# EasyEDA schematic Wireless.json
TITLE: Sheet_1; REV: 1.0; Date: 2024-10-12; Sheet: 1/1; Drawn By: romansuk05; Company: Your Company
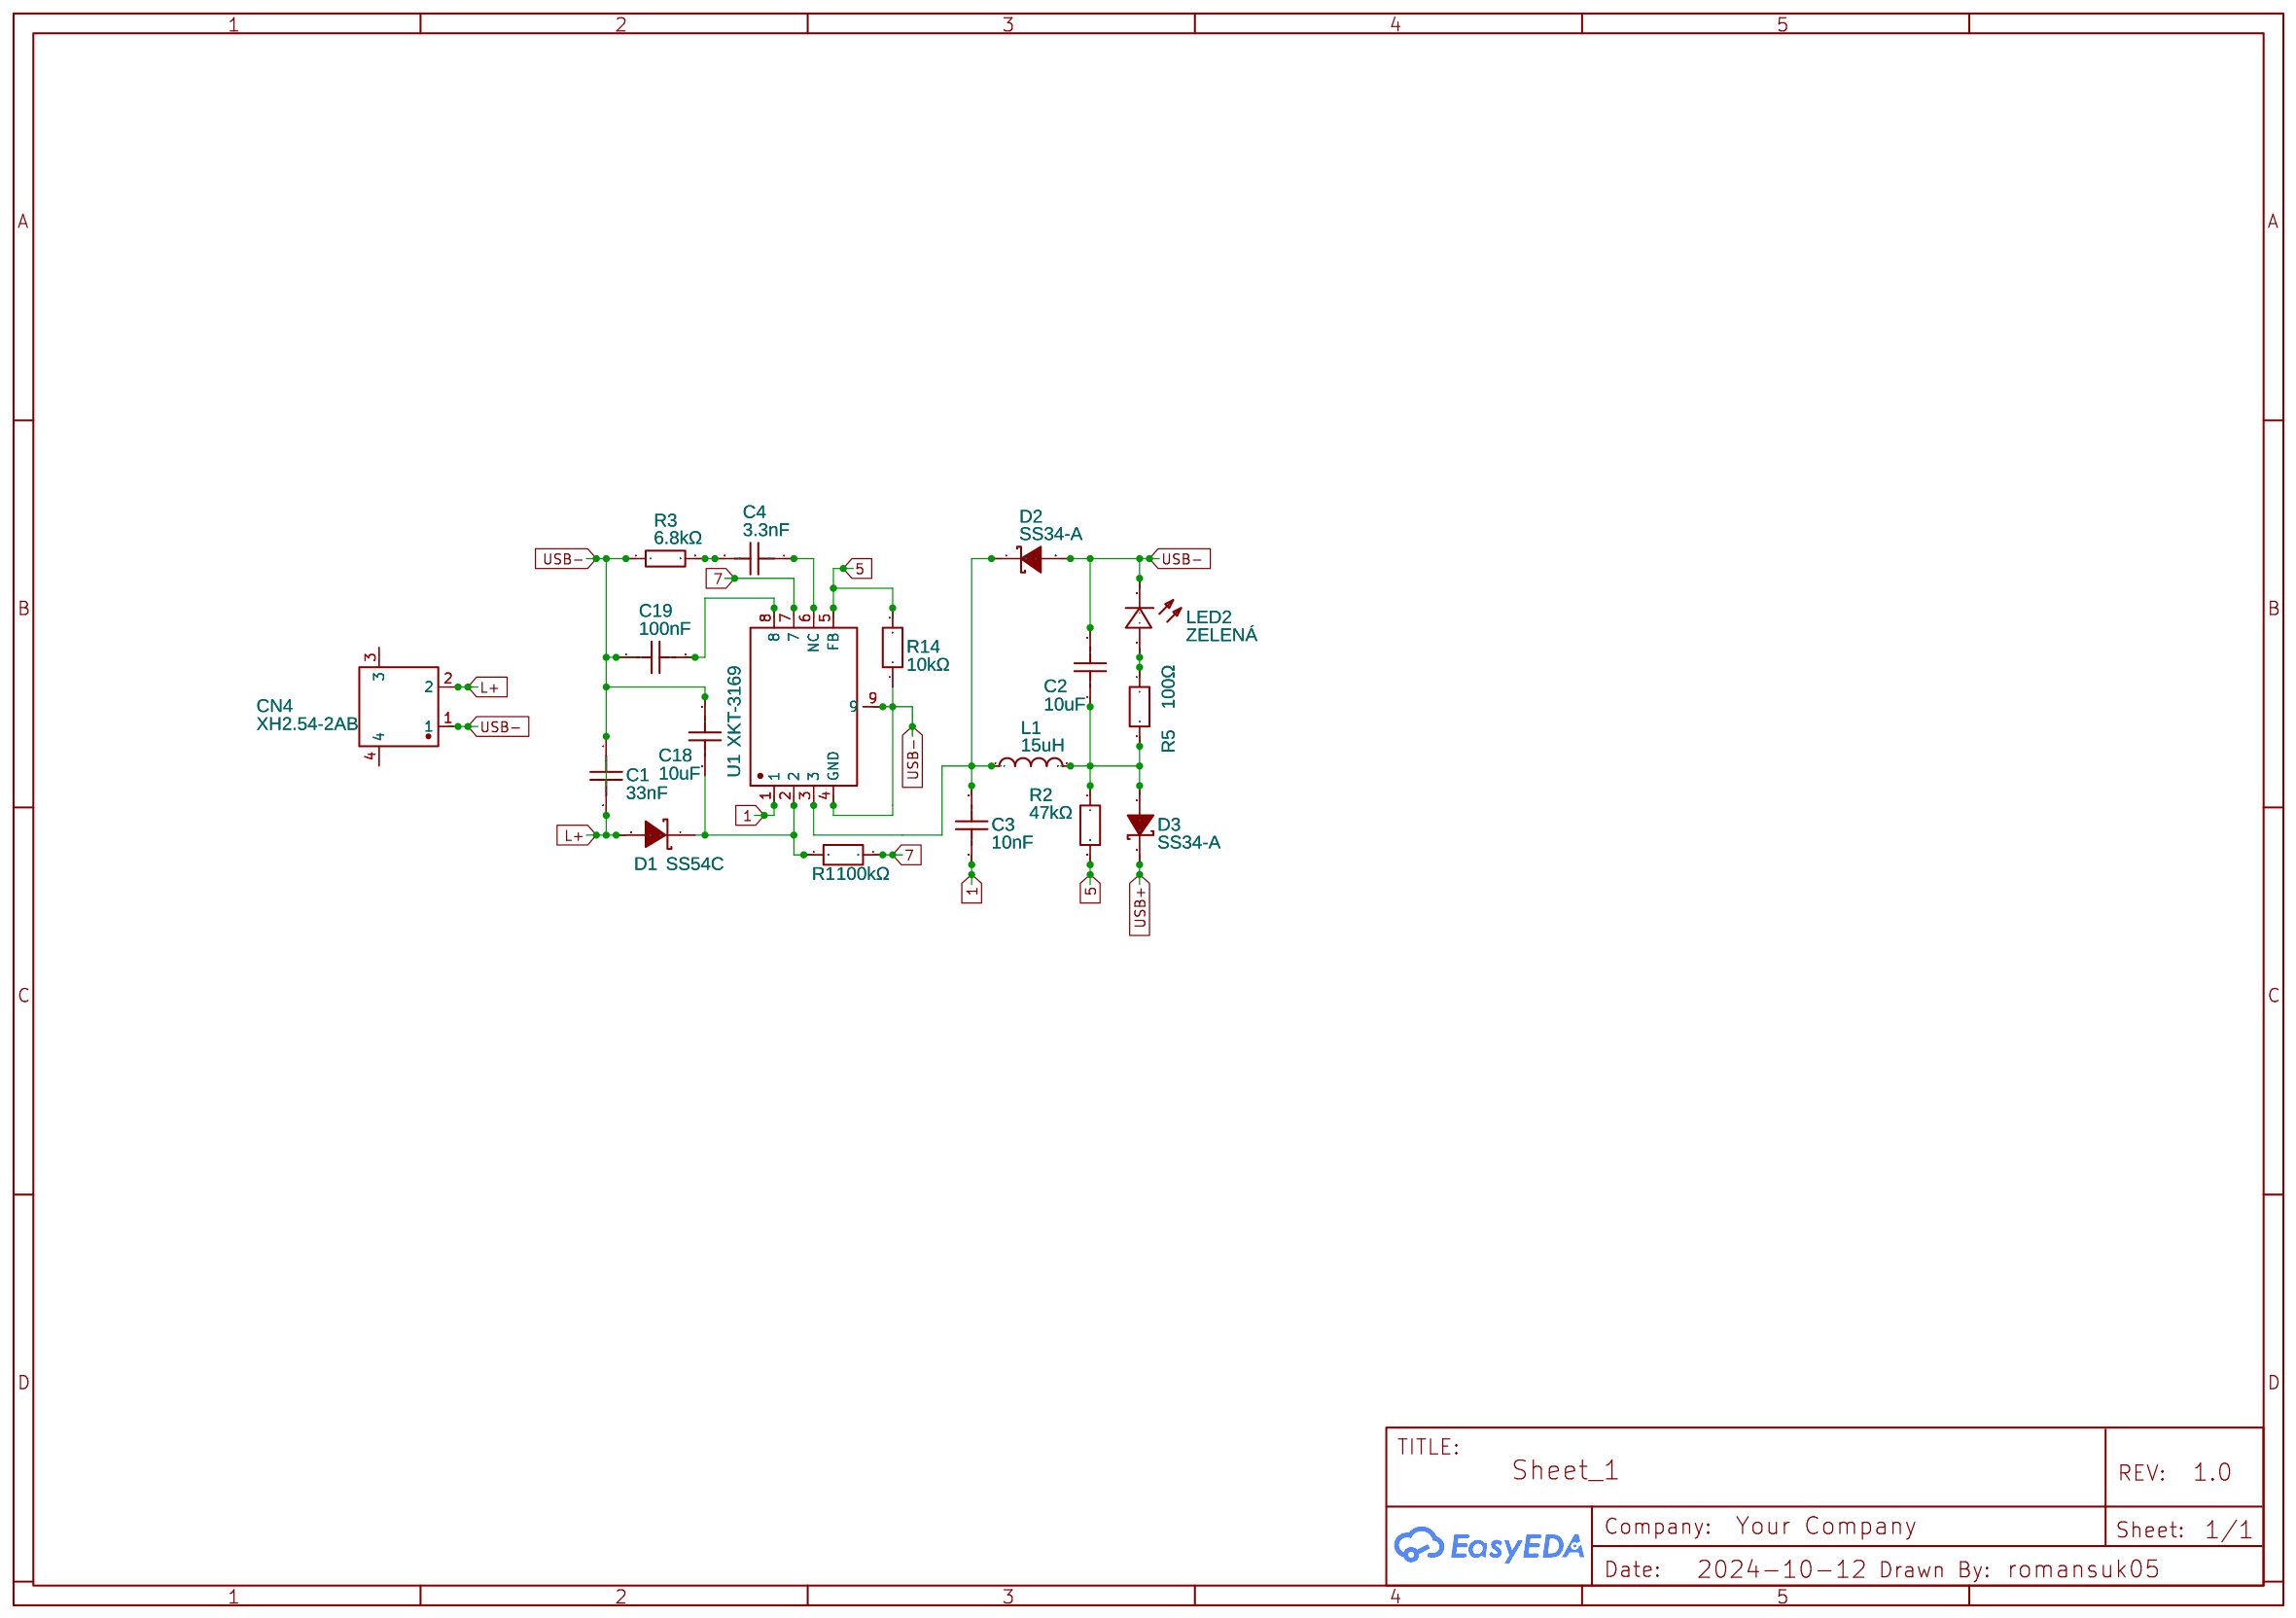
[diagram p0: schematic sheet]

## Parts
C1  33nF  [C1206]
C2  10uF  [C1206]
C3  10nF  [C1206]
C4  3.3nF  [C1206]
C18  10uF  [C1206]
C19  100nF  [C1206]
CN4  XH2.54-2AB  [CONN-SMD_2P-P2.54_XH2.54-2AB]
D1  SS54C  [SMC_L7.5-W5.8-LS8.3-RD]
D2  SS34-A  [SMA_L4.3-W2.6-LS5.2-RD]
D3  SS34-A  [SMA_L4.3-W2.6-LS5.2-RD]
L1  15uH  [IND-SMD_L4.5-W4.0]
LED2  ZELENÁ  [LED1206-R-RD_RED]
R1  100kΩ  [R1206]
R2  47kΩ  [R1206]
R3  6.8kΩ  [R1206]
R5  100Ω  [R1206]
R14  10kΩ  [R1206]
U1  XKT-3169  [SOIC-8_L4.9-W3.9-P1.27-LS6.0-BL]

## Library data of the parts
C1 = GRM31CR72E333KW03L: Supplier: LCSC; Manufacturer: muRata(村田); Supplier Part: C97957; JLCPCB Part Class: Extended Part
C2 C18 = TCC1206X7R106K250HT: Contributor: LCSC; Supplier: LCSC; Supplier Part: C380364; Manufacturer: CCTC(三环); JLCPCB Part Class: Extended Part
C3 = CC1206JKNPOZBN103: Supplier: LCSC; Supplier Part: C7500386; Manufacturer: YAGEO(国巨); Contributor: lcsc
C4 = TCC1206X7R332K501DT: Contributor: LCSC; Supplier: LCSC; Supplier Part: C377096; Manufacturer: CCTC(三环); JLCPCB Part Class: Extended Part
C19 = C1206X104J1RECAUTO7210: Contributor: lcsc; Supplier: LCSC; Supplier Part: C2253379; Manufacturer: KEMET(基美); JLCPCB Part Class: Extended Part
CN4 = XH2.54-2AB: Contributor: LCSC; Supplier: LCSC; Supplier Part: C146125; Manufacturer: BOOMELE(博穆精密); Manufacturer Part: XH-2P立贴; JLCPCB Part Class: Extended Part
D1 = SS54C: Contributor: LCSC; Supplier: LCSC; Supplier Part: C330398; Manufacturer: LGE(鲁光); Manufacturer Part: SS54; JLCPCB Part Class: Extended Part
D2 D3 = SS34-A: Contributor: LCSC; Supplier: LCSC; Supplier Part: C143201; Manufacturer: FMS(美丽微); JLCPCB Part Class: Extended Part
L1 = MSCD43-150KT: Contributor: LCSC; Supplier: LCSC; Supplier Part: C915171; Manufacturer: MetalLions(美铼); JLCPCB Part Class: Extended Part
LED2 = E6C1206URAC1UDA: Contributor: LCSC; Supplier: LCSC; Supplier Part: C375458; Manufacturer: ekinglux(亿晶源); JLCPCB Part Class: Extended Part
R1 = PTFR1206B100KN9: Contributor: lcsc; Supplier: LCSC; Supplier Part: C2692722; Manufacturer: RESI(开步睿思); JLCPCB Part Class: Extended Part
R2 = CR1206J47KP05: Contributor: LCSC; Supplier: LCSC; Supplier Part: C429214; Manufacturer: EVER OHMS(天二科技); JLCPCB Part Class: Extended Part
R3 = AC1206FR-076K8L: Contributor: LCSC; Supplier: LCSC; Supplier Part: C229771; Manufacturer: YAGEO(国巨); JLCPCB Part Class: Extended Part
R5 = SCR1206F100R: Contributor: lcsc; Supplier: LCSC; Supplier Part: C3017190; Manufacturer: VO(翔胜); JLCPCB Part Class: Extended Part
R14 = SCR1206F10K: Supplier: LCSC; Supplier Part: C3017025; Manufacturer: VO(翔胜); JLCPCB Part Class: Extended Part; Contributor: lcsc
U1 = XKT-3169: Manufacturer: MAXIM; Supplier Part: C7266; Contributor: drashtipandya2020

## Nets
1: C3.1 U1.1
5: R2.2 R14.2 U1.5(FB)
7: R1.2 U1.7
L+: C1.2 CN4.2 D1.2(A)
USB+: D3.1(C)
USB-: C1.1 C2.1 C18.1 C19.1 CN4.1 D2.2(A) LED2.2(-) R3.1 R14.1 U1.4(GND) U1.9
Net-(C2-2): C2.2 D3.2(A) L1.2 R2.1 R5.2
Net-(C3-2): C3.2 D2.1(C) L1.1 U1.3
Net-(C4-1): C4.1 U1.6(NC)
Net-(C4-2): C4.2 R3.2
Net-(C18-2): C18.2 D1.1(K) R1.1 U1.2
Net-(C19-2): C19.2 U1.8
Net-(LED2-1): LED2.1(+) R5.1

Not connected (* = marked no-connect by the designer): CN4 3 4
